# Altium project 28pins_project.PrjPcb (part 3 of 3)
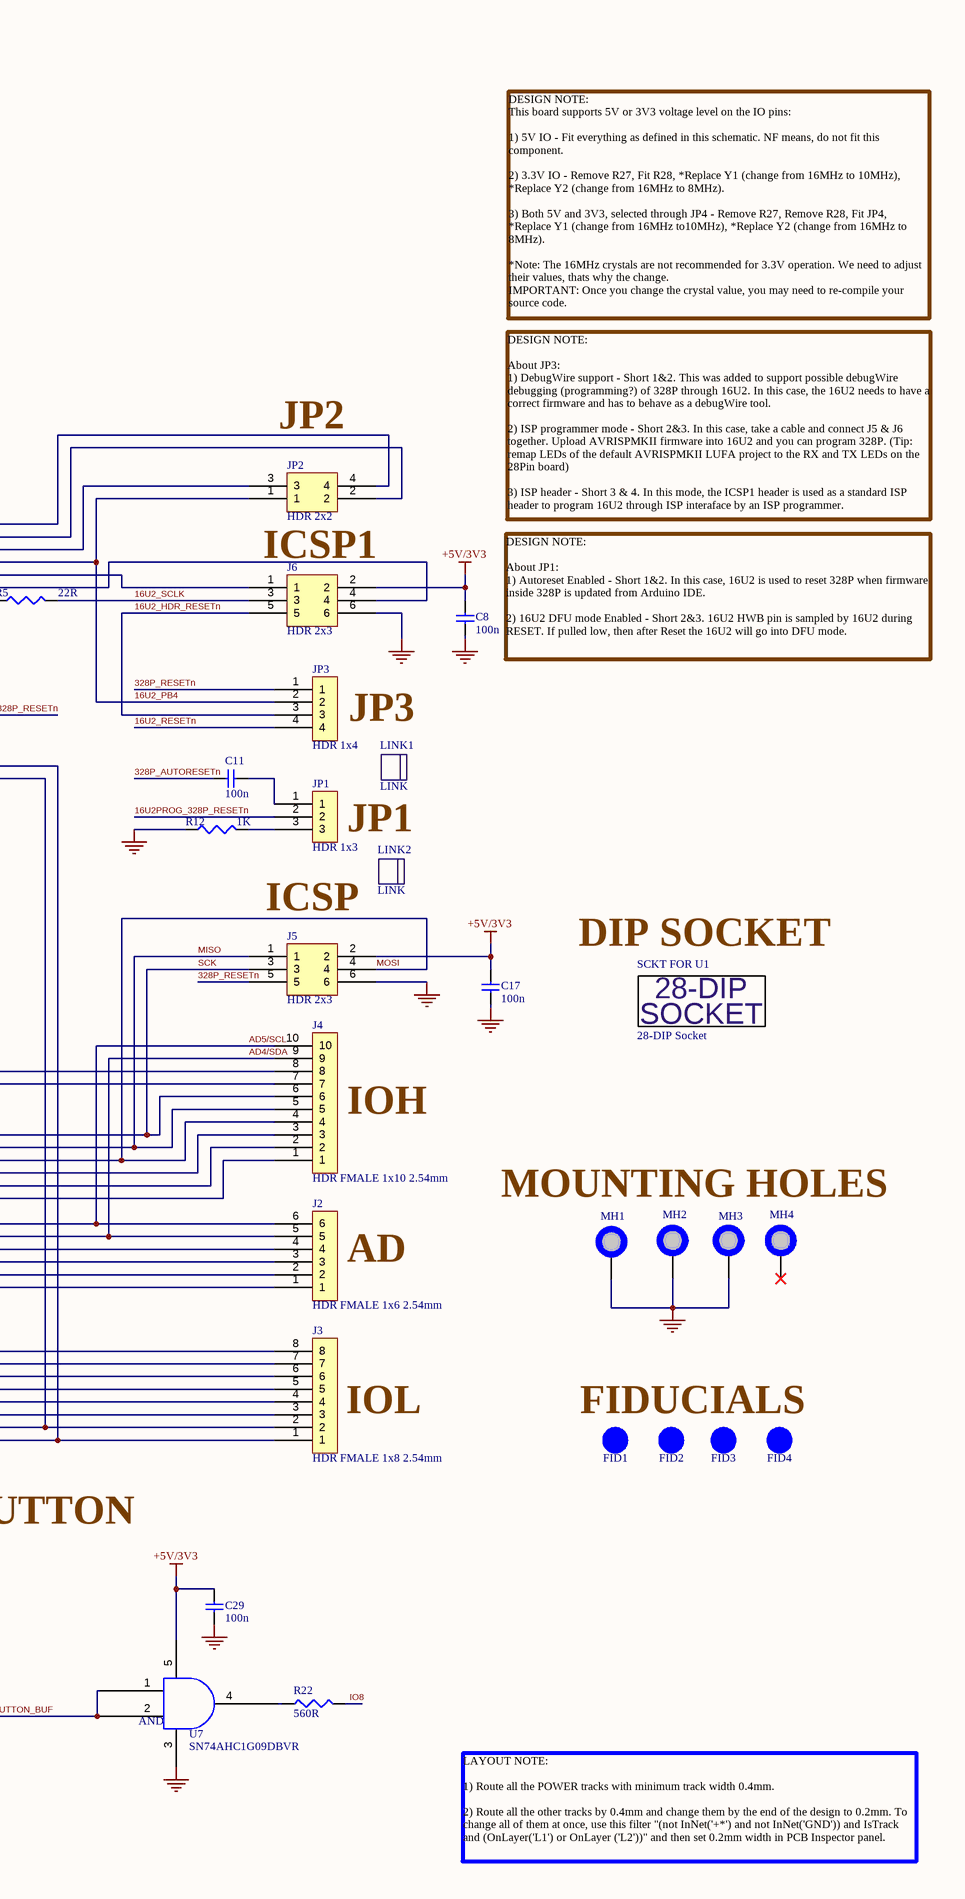
[diagram p5: [03] - 28PINS SCHEMATIC.SchDoc, right]

## Sheet [03] - 28PINS SCHEMATIC.SchDoc: 28Pins (continued)

### Library data of the parts (continued)
U1 = ATMEGA328P-PU: RISC Microcontroller, 8-Bit, FLASH, AVR RISC CPU, 20MHz, CMOS, PDIP28; Manufacturer: Microchip; Package Body Material: Plastic; Number of I/O Lines: 23; Package Equivalence Code: DIP28,.3; Power Supplies: 2.5; Max Supply Current: 9mA; Max Supply Voltage: 5.5V; Min Supply Voltage: 4.5V; Nominal Supply Voltage: 5V; Surface Mount: No; Peripherals: POR,PWM,WDT; Interface: SPI,USART; Qualification Status: Not Qualified; Supplier: Arrow Electronics; Supplier Part Number: ATMEGA328P-PU; Manufacturer Part Number: ATMEGA328P-PU; RoHS: Yes; Category: Microcontrollers; Stock: 9130; Pricing: 1=1.918, 112=1.899, 504=1.88 (USD); Case/Package: DIP; Pins: 28; Package Shape: Rectangular; Terminal Finish: Tin; Min Operating Temperature: -40°C; Max Operating Temperature: 85°C; JESD-609 Code: e3; Clock Frequency: 20MHz; JESD-30 Code: R-PDIP-T28; Technology: CMOS; Terminal Form: Through Hole; Terminal Position: DUAL; Length: 34.671mm; Width: 7.62mm; Height - Seated (Max): 4.5724mm; Terminal Pitch: 2.54mm; Temperature Grade: INDUSTRIAL; Reach SVHC Compliant: Yes; RoHS Compliant: Yes; ComponentLink1URL: https://datasheet.ciiva.com:443/pdfs/VipMasterIC/IC/ATML/ATML-S-A0002642585/ATML-S-A0002642585-1.pdf?src-supplier=IHS+Markit; ComponentLink1Description: https://datasheet.ciiva.com:443/pdfs/VipMasterIC/IC/ATML/ATML-S-A0002642585/ATML-S-A0002642585-1.pdf?src-supplier=IHS+Markit; ComponentLink2URL: https://datasheet.ciiva.com/19457/2139111-19457070.pdf?src-supplier=Jameco; ComponentLink2Description: https://datasheet.ciiva.com/19457/2139111-19457070.pdf?src-supplier=Jameco; ComponentLink3URL: https://datasheet.ciiva.com/1157/1684409-1157696.pdf?src-supplier=Element14; ComponentLink3Description: https://datasheet.ciiva.com/1157/1684409-1157696.pdf?src-supplier=Element14; ComponentLink4URL: https://datasheet.ciiva.com/29119/155197-da-01-en-microcontr-atmega328p-pu-8bit-pdip-28-29119593.pdf?src-supplier=Conrad; ComponentLink4Description: https://datasheet.ciiva.com/29119/155197-da-01-en-microcontr-atmega328p-pu-8bit-pdip-28-29119593.pdf?src-supplier=Conrad; ComponentLink5URL: https://datasheet.ciiva.com/15213/getdatasheetpartid-318533-15213133.pdf?src-supplier=Verical; ComponentLink5Description: https://datasheet.ciiva.com/15213/getdatasheetpartid-318533-15213133.pdf?src-supplier=Verical
U2 = ATMEGA16U2-AU: RISC Microcontroller, 8-Bit, FLASH, AVR RISC CPU, 16MHz, CMOS, PQFP32; Manufacturer: Microchip; Package Body Material: Plastic; Power Supplies: 3/5; Max Supply Current: 21mA; Number of I/O Lines: 22; Max Supply Voltage: 5.5V; Min Supply Voltage: 4.5V; Nominal Supply Voltage: 5V; Peripherals: POR,WDT; Interface: SPI,USB,USART; Qualification Status: Not Qualified; Supplier: Arrow Electronics; Supplier Part Number: ATMEGA16U2-AU; Manufacturer Part Number: ATMEGA16U2-AU; RoHS: Yes; Category: Microcontrollers; Stock: 1337; Pricing: 1=2.919 (USD); Case/Package: TQFP; Pins: 32; Package Shape: Square; Min Operating Temperature: -40°C; Max Operating Temperature: 85°C; JESD-30 Code: S-PQFP-G32; Surface Mount: Yes; Technology: CMOS; Terminal Form: Gull Wing; Terminal Position: QUAD; Clock Frequency: 16MHz; Length: 7mm; Width: 7mm; Terminal Pitch: 0.8mm; Height - Seated (Max): 1.2mm; Temperature Grade: INDUSTRIAL; Reach SVHC Compliant: Yes; RoHS Compliant: Yes; ComponentLink1URL: https://datasheet.ciiva.com:443/pdfs/VipMasterIC/IC/ATML/ATMLS06884/ATMLS06884-1.pdf?src-supplier=IHS+Markit; ComponentLink1Description: https://datasheet.ciiva.com:443/pdfs/VipMasterIC/IC/ATML/ATMLS06884/ATMLS06884-1.pdf?src-supplier=IHS+Markit; ComponentLink2URL: https://datasheet.ciiva.com/13036/doc7799-28769-13036800.pdf?src-supplier=Mouser; ComponentLink2Description: https://datasheet.ciiva.com/13036/doc7799-28769-13036800.pdf?src-supplier=Mouser; ComponentLink3URL: https://datasheet.ciiva.com/22651/doc7799-22651110.pdf?src-supplier=Farnell; ComponentLink3Description: https://datasheet.ciiva.com/22651/doc7799-22651110.pdf?src-supplier=Farnell
U3 = TL1963A-33DCQR: Fixed Positive LDO Regulator, 3.3V, 0.55V Dropout, BIPolar, PDSO6; Manufacturer: Texas Instruments; Package Body Material: Plastic; Dropout Voltage1-Max: 550mV; Dropout Voltage1-Nom: 340mV; Input Voltage Absolute-Max: 20V; Min Input Voltage: 3.8V; Channels: 1; Output Current1-Max: 1.5A; Output Voltage1-Max: 3.4V; Output Voltage1-Min: 3.2V; Regulator Type: FIXED POSITIVE SINGLE OUTPUT LDO REGULATOR; Voltage Tolerance-Max: 3%; Qualification Status: Not Qualified; Supplier: Mouser; Supplier Part Number: 595-TL1963A-33DCQR; Manufacturer Part Number: TL1963A-33DCQR; RoHS: Yes; Category: Voltage Regulators - Linear; Stock: 4261; Pricing: 1=3.07, 10=2.2, 50=2.2, 100=1.99, 1000=1.82, 10000=1.61 (USD); Case/Package: SOP; Pins: 6; Package Shape: Rectangular; Terminal Finish: Nickel; JESD-609 Code: e4; Adjustability: FIXED; Max Supply Voltage: 20V; JESD-30 Code: R-PDSO-G6; Moisture Sensitivity Level: 2; Number of Outputs: 1; Operating Temperature, TJ-Max: 125°C; Operating Temperature, TJ-Min: -40°C; Output Voltage1-Nom: 3.3V; Packaging: Tape and Reel; Peak Reflow Temperature (Cel): 260°C; Surface Mount: Yes; Technology: BIPOLAR; Terminal Form: Gull Wing; Terminal Position: DUAL; Length: 6.5mm; Width: 3.5mm; Height - Seated (Max): 1.8mm; Terminal Pitch: 1.27mm; Reach SVHC Compliant: Yes; RoHS Compliant: Yes; ComponentLink1URL: https://www.ti.com:443/lit/ds/symlink/tl1963a.pdf?src-supplier=IHS+Markit; ComponentLink1Description: https://www.ti.com:443/lit/ds/symlink/tl1963a.pdf?src-supplier=IHS+Markit; ComponentLink2URL: https://datasheet.ciiva.com/2046/tl1963a-2046162.pdf?src-supplier=Digikey; ComponentLink2Description: https://datasheet.ciiva.com/2046/tl1963a-2046162.pdf?src-supplier=Digikey; ComponentLink3URL: https://datasheet.ciiva.com/2046/tl1963a-2046161.pdf?src-supplier=Digikey; ComponentLink3Description: https://datasheet.ciiva.com/2046/tl1963a-2046161.pdf?src-supplier=Digikey; ComponentLink4URL: https://datasheet.ciiva.com/2046/tl1963a-2046163.pdf?src-supplier=Digikey; ComponentLink4Description: https://datasheet.ciiva.com/2046/tl1963a-2046163.pdf?src-supplier=Digikey
U4-U7 = SN74AHC1G09DBVR: AND Gate, AHC/VHC/H/U/V Series, 1-Func, 2-Input, CMOS, PDSO5; Manufacturer: Texas Instruments; Package Body Material: Plastic; Load Capacitance (CL): 50pF; Max I(ol): 8mA; Channels: 1; Number of Inputs: 2; Output Characteristics: OPEN-DRAIN; Package Equivalence Code: TSOP5/6,.11,37; Power Supplies: 2/5.5V; Prop. Delay@Nom-Sup: 8.5ns; Propagation Delay (tpd): 12.5ns; Schmitt Trigger: No; Max Supply Voltage: 5.5V; Min Supply Voltage: 2V; Nominal Supply Voltage: 3.3V; Qualification Status: Not Qualified; Supplier: Mouser; Supplier Part Number: 595-SN74AHC1G09DBVR; Manufacturer Part Number: SN74AHC1G09DBVR; RoHS: Yes; Category: Logic Gates; Stock: 17466; Pricing: 1=0.12, 10=0.07, 50=0.07, 100=0.051, 1000=0.049, 10000=0.041 (USD); Case/Package: LSSOP; Pins: 5; Package Shape: Rectangular; Terminal Finish: Nickel; Min Operating Temperature: -55°C; Max Operating Temperature: 125°C; JESD-609 Code: e4; JESD-30 Code: R-PDSO-G5; Logic Type: AND GATE; Moisture Sensitivity Level: 1; Package Style: SMALL OUTLINE, LOW PROFILE, SHRINK PITCHMeter; Packaging: Tape and Reel; Peak Reflow Temperature (Cel): 260°C; Surface Mount: Yes; Technology: CMOS; Terminal Form: Gull Wing; Terminal Position: DUAL; Length: 2.9mm; Width: 1.6mm; Height - Seated (Max): 1.45mm; Terminal Pitch: 0.95mm; Temperature Grade: MILITARY; Reach SVHC Compliant: Yes; RoHS Compliant: Yes; ComponentLink1URL: https://www.ti.com:443/lit/ds/symlink/sn74ahc1g09.pdf?src-supplier=IHS+Markit; ComponentLink1Description: https://www.ti.com:443/lit/ds/symlink/sn74ahc1g09.pdf?src-supplier=IHS+Markit; ComponentLink2URL: https://datasheet.ciiva.com/1864/sn74ahc1g09-1864411.pdf?src-supplier=Digikey; ComponentLink2Description: https://datasheet.ciiva.com/1864/sn74ahc1g09-1864411.pdf?src-supplier=Digikey; ComponentLink3URL: https://datasheet.ciiva.com/1864/sn74ahc1g09-1864410.pdf?src-supplier=Digikey; ComponentLink3Description: https://datasheet.ciiva.com/1864/sn74ahc1g09-1864410.pdf?src-supplier=Digikey; ComponentLink4URL: https://datasheet.ciiva.com/1864/sn74ahc1g09-1864412.pdf?src-supplier=Digikey; ComponentLink4Description: https://datasheet.ciiva.com/1864/sn74ahc1g09-1864412.pdf?src-supplier=Digikey
Y1 Y2 = ECS-160-18-23G-JGN-TR: Parallel - Fundamental Quartz Crystal, 16MHz Nom; Manufacturer: ECS International; Supplier: Arrow Electronics; Supplier Part Number: ECS-160-18-23G-JGN-TR; Manufacturer Part Number: ECS-160-18-23G-JGN-TR; RoHS: Yes; Category: LDO; Stock: 5000; Pricing: 1000=0.4614, 2000=0.4426, 3000=0.432, 5000=0.4189, 7000=0.4105, 10000=0.4018, 25000=0.3876 (USD); Terminal Finish: Gold; JESD-609 Code: e4; Crystal/Resonator Type: PARALLEL - FUNDAMENTAL; Reach SVHC Compliant: Yes; RoHS Compliant: Yes; ComponentLink1URL: https://datasheet.ciiva.com:443/pdfs/VipMasterIC/IC/ECSI/ECSI-S-A0007662220/ECSI-S-A0007662220-1.pdf?src-supplier=IHS+Markit; ComponentLink1Description: https://datasheet.ciiva.com:443/pdfs/VipMasterIC/IC/ECSI/ECSI-S-A0007662220/ECSI-S-A0007662220-1.pdf?src-supplier=IHS+Markit; ComponentLink2URL: https://www.ecsxtal.com/store/pdf/ECS-23G.pdf?src-supplier=Digikey; ComponentLink2Description: https://www.ecsxtal.com/store/pdf/ECS-23G.pdf?src-supplier=Digikey
Z1 Z2 = CG0603MLC-05E: Varistor, 5V, Surface Mount; Manufacturer: Bourns; Circuit RMS Voltage-Max: 20V; Reference Standard: AEC-Q200; Supplier: Rs; Supplier Part Number: 1814489; Manufacturer Part Number: CG0603MLC-05E; RoHS: Yes; Category: Varistors; Stock: 1500; Pricing: 250=0.132, 1000=0.116, 2500=0.102 (EUR); Mounting Technology: Surface Mount; Pins: 2; Package Shape: Rectangular; Terminal Finish: Tin; Min Operating Temperature: -40°C; Max Operating Temperature: 85°C; JESD-609 Code: e3; Resistor Type: VARISTOR; Circuit DC Voltage-Max: 5V; Packaging: Tape and Reel; Terminal Placement: Dual Ended; Termination: Wraparound; Reach SVHC Compliant: Yes; RoHS Compliant: Yes; ComponentLink1URL: https://datasheet.ciiva.com:443/pdfs/VipMasterIC/IC/BOUR/BOUR-S-A0008954794/BOUR-S-A0008954794-1.pdf?src-supplier=IHS+Markit; ComponentLink1Description: https://datasheet.ciiva.com:443/pdfs/VipMasterIC/IC/BOUR/BOUR-S-A0008954794/BOUR-S-A0008954794-1.pdf?src-supplier=IHS+Markit; ComponentLink2URL: https://datasheet.ciiva.com/27747/1163231-27747629.pdf?src-supplier=Jameco; ComponentLink2Description: https://datasheet.ciiva.com/27747/1163231-27747629.pdf?src-supplier=Jameco; ComponentLink3URL: https://datasheet.ciiva.com/22696/1785244-22696318.pdf?src-supplier=Element14; ComponentLink3Description: https://datasheet.ciiva.com/22696/1785244-22696318.pdf?src-supplier=Element14; ComponentLink4URL: https://datasheet.ciiva.com/6991/mlc-6991834.pdf?src-supplier=Digikey; ComponentLink4Description: https://datasheet.ciiva.com/6991/mlc-6991834.pdf?src-supplier=Digikey; ComponentLink5URL: https://datasheet.ciiva.com/6991/mlc-6991836.pdf?src-supplier=Digikey; ComponentLink5Description: https://datasheet.ciiva.com/6991/mlc-6991836.pdf?src-supplier=Digikey; ComponentLink6URL: https://datasheet.ciiva.com/6991/mlc-6991832.pdf?src-supplier=Digikey; ComponentLink6Description: https://datasheet.ciiva.com/6991/mlc-6991832.pdf?src-supplier=Digikey; ComponentLink7URL: https://datasheet.ciiva.com/30070/mlc-30070503.pdf?src-supplier=Onlinecomponents.com; ComponentLink7Description: https://datasheet.ciiva.com/30070/mlc-30070503.pdf?src-supplier=Onlinecomponents.com

## Assembly variants
FIXED 5V: not fitted JP2 JP4 LINK3 R26 R28
5V/3V3: not fitted JP2 R26 R27 R28; alternate parts Y1 -> ABM7-10.000MHZ-D2Y-T, Y2 -> ABM7-8.000MHZ-D2Y-T